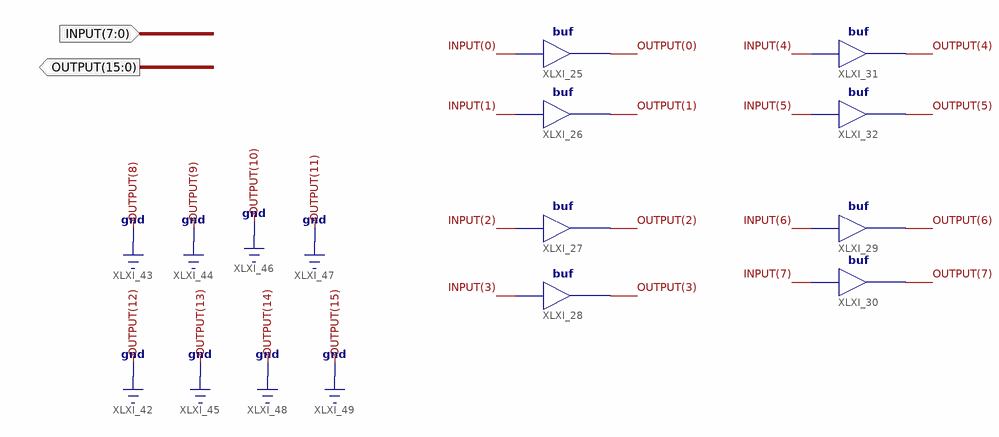
[diagram p0: schematic sheet 1]
// Xilinx ISE schematic ZE.sch (spartan3e) as structural Verilog: 8 symbols, 2 ports
module ZE (
  input  [7:0] INPUT,
  output [15:0] OUTPUT
);

  buf XLXI_25 (OUTPUT[0], INPUT[0]);
  buf XLXI_26 (OUTPUT[1], INPUT[1]);
  buf XLXI_27 (OUTPUT[2], INPUT[2]);
  buf XLXI_28 (OUTPUT[3], INPUT[3]);
  buf XLXI_31 (OUTPUT[4], INPUT[4]);
  buf XLXI_32 (OUTPUT[5], INPUT[5]);
  buf XLXI_29 (OUTPUT[6], INPUT[6]);
  buf XLXI_30 (OUTPUT[7], INPUT[7]);

  assign OUTPUT[15:8] = {8{1'b0}};
endmodule
